# Altium schematic sheet main.SchDoc
size A4; SheetNumber: 1; SheetTotal: 3
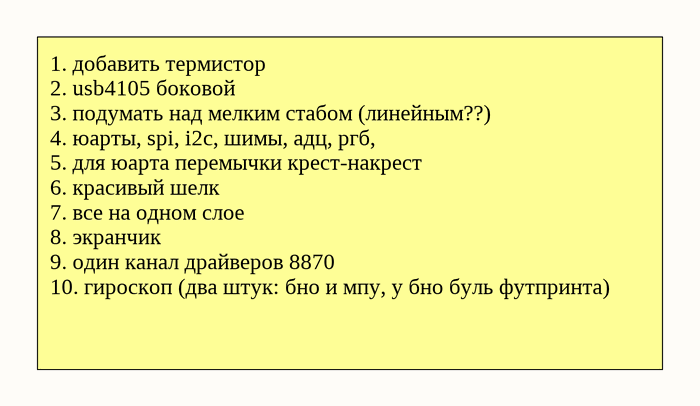
[diagram p0: main.SchDoc]

## Notes on the sheet
- 1. добавить термистор
  2. usb4105 боковой
  3. подумать над мелким стабом (линейным??)
  4. юарты, spi, i2c, шимы, адц, ргб,
  5. для юарта перемычки крест-накрест
  6. красивый шелк
  7. все на одном слое
  8. экранчик
  9. один канал драйверов 8870
  10. гироскоп (два штук: бно и мпу, у бно буль футпринта)